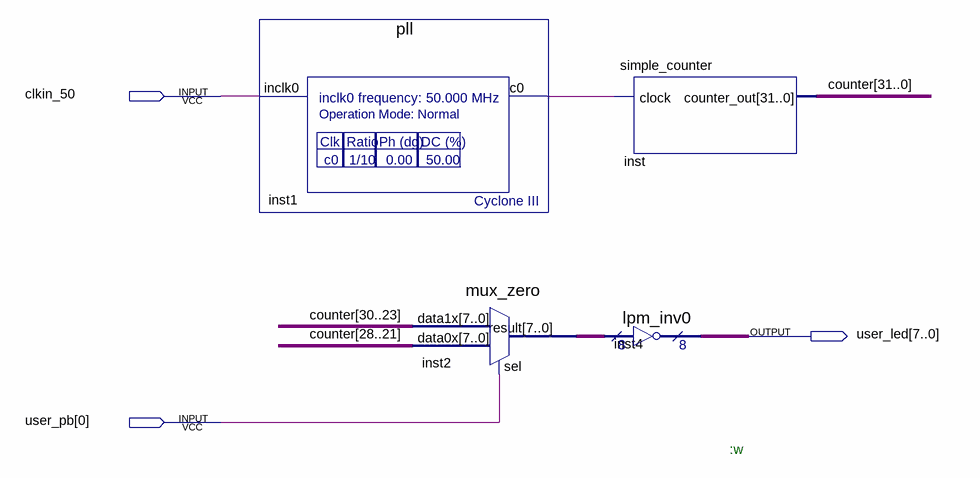
[diagram p0: schematic sheet]
// Quartus schematic cycloneIII_3c120_dev_my_first_fpga_top.bdf as structural Verilog: 4 symbols, 3 pins
module cycloneIII_3c120_dev_my_first_fpga_top (
  input  clkin_50,
  input  [0:0] user_pb,
  output [7:0] user_led
);

  wire inst1_c0;
  wire [7:0] inst2_result;
  wire [31:0] counter;

  pll inst1 (.inclk0(clkin_50), .c0(inst1_c0));
  mux_zero inst2 (.data1x(counter[30:23]), .data0x(counter[28:21]), .sel(user_pb[0]), .result(inst2_result));
  simple_counter inst (.clock(inst1_c0), .counter_out(counter));
  lpm_inv0 inst4 (.data(inst2_result), .result(user_led));

  // Notes on the sheet:
  //   :w
endmodule
